# EAGLE design T08_rc360detector (EAGLE 7.4.0)
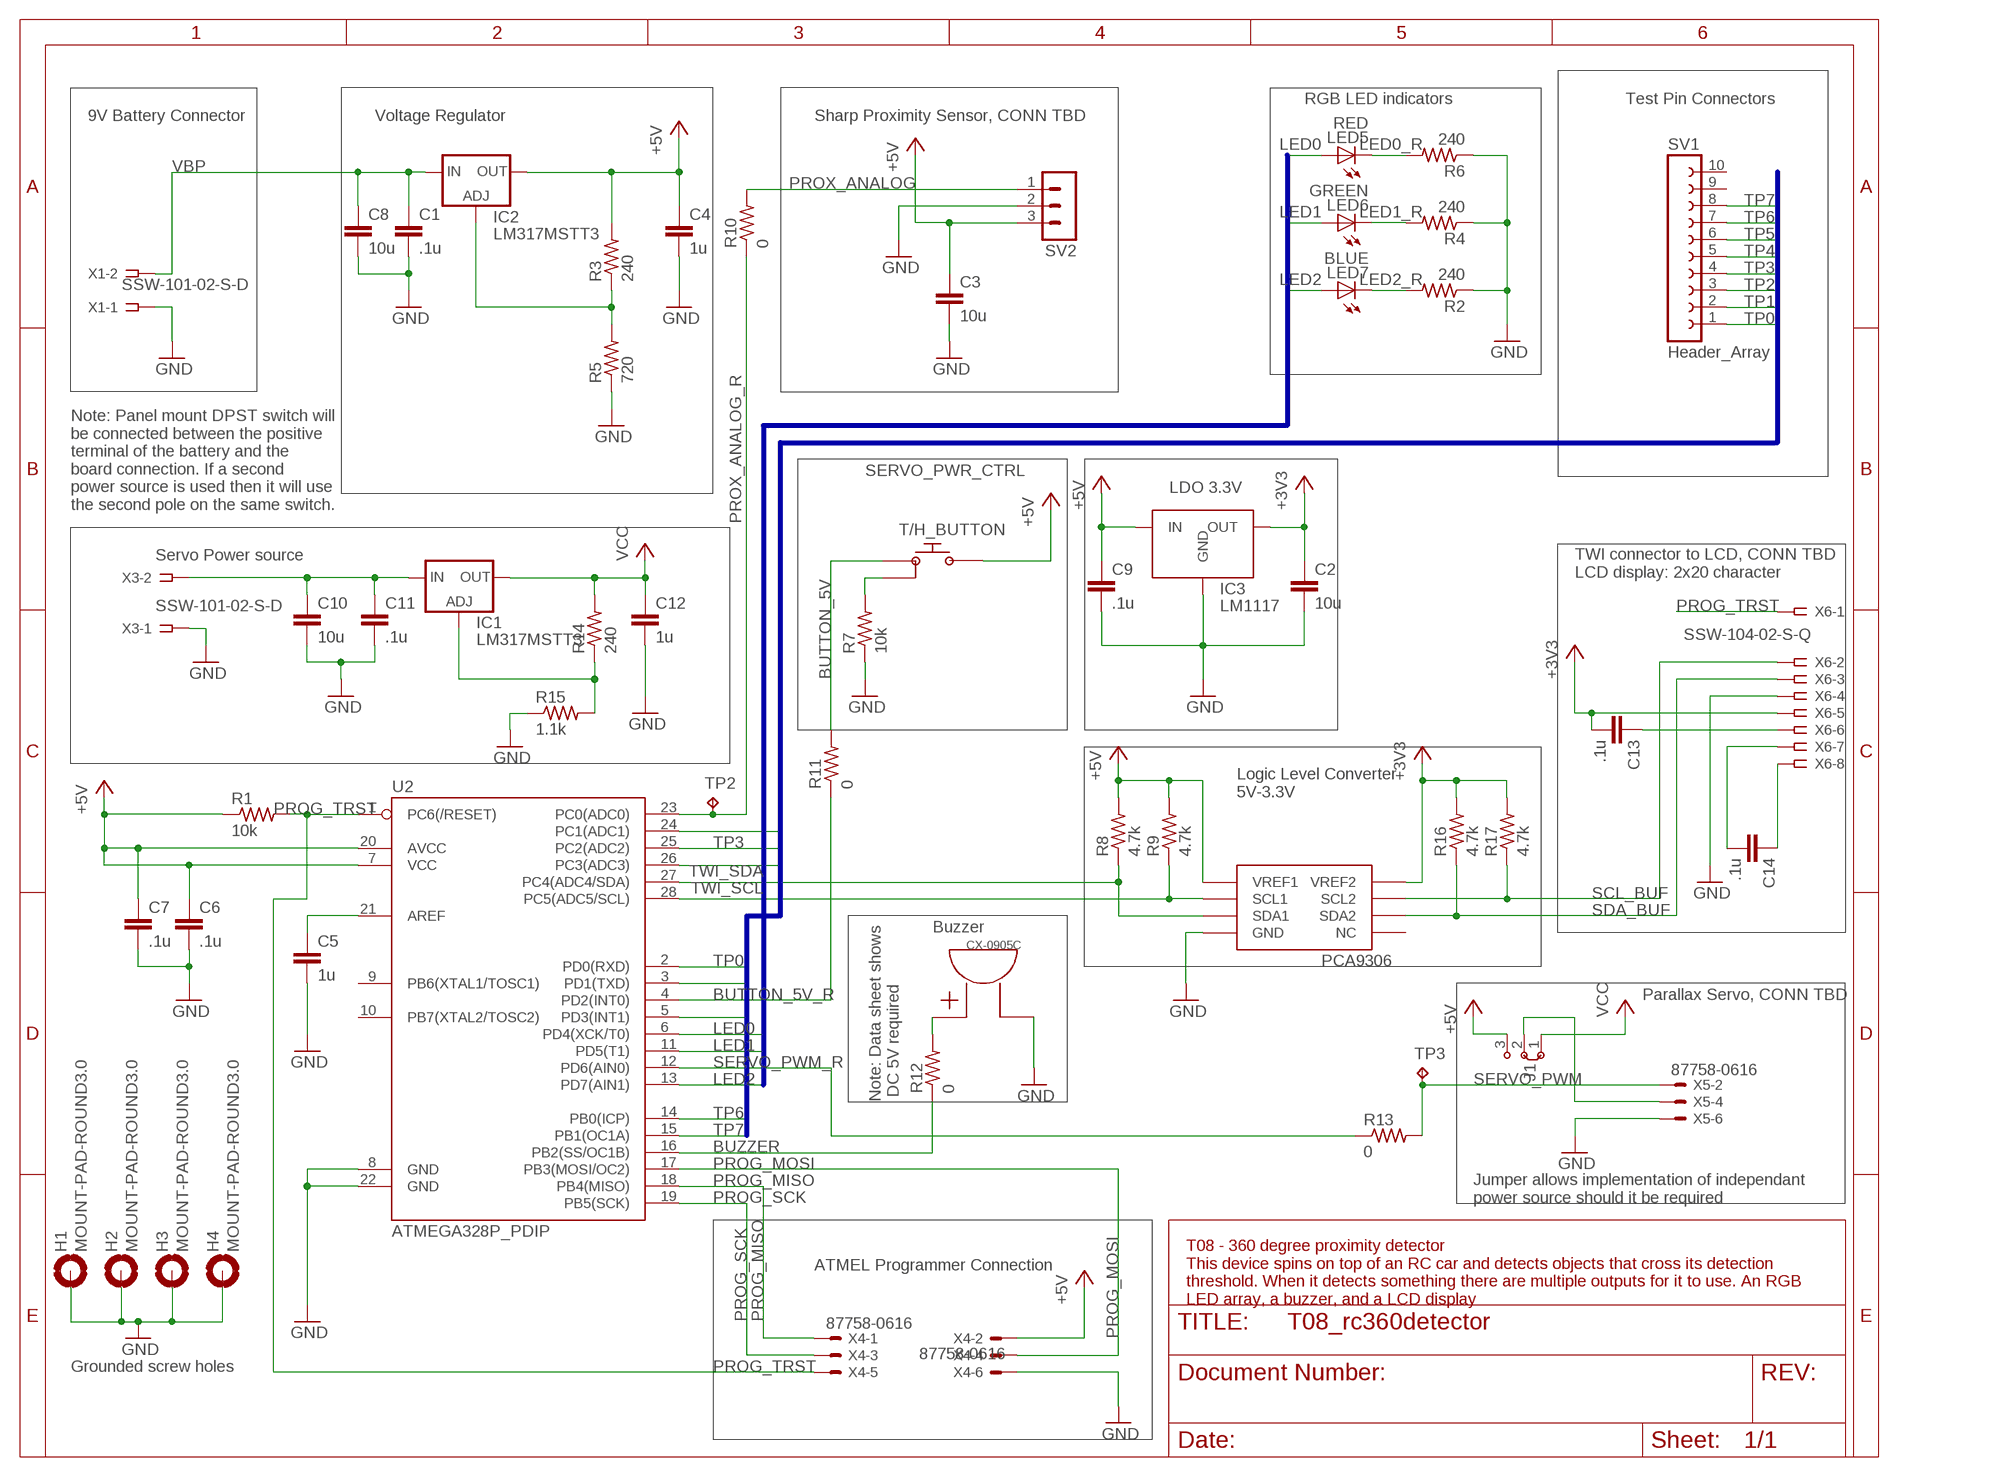
[diagram p0: schematic, sheet 1]

## Parts
C1  .1u  C-EUC0805  [C0805]
C2  10u  C-EUC0805  [C0805]
C3  10u  C-EUC0805  [C0805]
C4  1u  C-EUC0805  [C0805]
C5  1u  C-EUC0805  [C0805]
C6  .1u  C-EUC0805  [C0805]
C7  .1u  C-EUC0805  [C0805]
C8  10u  C-EUC0805  [C0805]
C9  .1u  C-EUC0805  [C0805]
C10  10u  C-EUC0805  [C0805]
C11  .1u  C-EUC0805  [C0805]
C12  1u  C-EUC0805  [C0805]
C13  .1u  C-EUC0805  [C0805]
C14  .1u  C-EUC0805  [C0805]
CX-0905C  CX-0905C  [BUZZER_CX-0905C]
H1  MOUNT-PAD-ROUND3.0  [3,0-PAD]
H2  MOUNT-PAD-ROUND3.0  [3,0-PAD]
H3  MOUNT-PAD-ROUND3.0  [3,0-PAD]
H4  MOUNT-PAD-ROUND3.0  [3,0-PAD]
IC1  LM317MSTT3  [SOT223]
IC2  LM317MSTT3  [SOT223]
IC3  LM1117  [SOT-223]
J1  J2X2MM  [04C]
LED5  RED  LEDLD260  [LD260]
LED6  GREEN  LEDLD260  [LD260]
LED7  BLUE  LEDLD260  [LD260]
PCA9306  PCA9306_BREAKOUT  [PCA9306_BREAKOUT]
R1  10k  R-US_R0805  [R0805]
R2  240  R-US_R0805  [R0805]
R3  240  R-US_R0805  [R0805]
R4  240  R-US_R0805  [R0805]
R5  720  R-US_R0805  [R0805]
R6  240  R-US_R0805  [R0805]
R7  10k  R-US_R0805  [R0805]
R8  4.7k  R-US_R0805  [R0805]
R9  4.7k  R-US_R0805  [R0805]
R10  0  R-US_R0805  [R0805]
R11  0  R-US_R0805  [R0805]
R12  0  R-US_R0805  [R0805]
R13  0  R-US_R0805  [R0805]
R14  240  R-US_R0805  [R0805]
R15  1.1k  R-US_R0805  [R0805]
R16  4.7k  R-US_R0805  [R0805]
R17  4.7k  R-US_R0805  [R0805]
SV1  Header_Array  FE10-1  [FE10]
SV2  MA03-1  [MA03-1]
T/H_BUTTON  PR141C  [3_THROUGH_HOLE]
TP2  TPPAD1-17  [P1-17]
TP3  TPPAD1-17  [P1-17]
U2  ATMEGA328P_PDIP  [DIL28-3]
X1  SSW-101-02-S-D  [SSW-101-02-S-D]
X3  SSW-101-02-S-D  [SSW-101-02-S-D]
X4  87758-0616  [87758-0616]
X5  87758-0616  [87758-0616]
X6  SSW-104-02-S-Q  [SSW-104-02-S-Q]

## Nets
+3V3: C2.1 C13.2 IC3.VOUT(OUT) PCA9306.VREF2 R16.2 R17.2 X6.5
+5V: C3.1 C4.1 C6.1 C7.1 C9.1 IC2.4(OUT) IC3.IN J1.3 PCA9306.VREF1 R1.1 R3.2 R8.2 R9.2 SV2.3 T/H_BUTTON.P$3(OUT) U2.7(VCC) U2.20(AVCC) X4.2
AREF: C5.1 U2.21(AREF)
BUTTON_5V: R11.2 T/H_BUTTON.P$1(IN)
BUTTON_5V_R: R11.1 U2.4(PD2(INT0))
BUZZER: R12.1 U2.16(PB2(SS/OC1B))
GND: C1.2 C2.2 C3.2 C4.2 C5.2 C6.2 C7.2 C8.2 C9.2 C10.2 C11.2 C12.2 CX-0905C.OUT H1.B3,0(MOUNT) H2.B3,0(MOUNT) H3.B3,0(MOUNT) H4.B3,0(MOUNT) IC3.GND PCA9306.GND R2.1 R4.1 R5.1 R6.1 R7.1 R15.1 SV2.2 U2.8(GND) U2.22(GND) X1.1 X3.1 X4.6 X5.6 X6.4
LED0: LED5.A U2.6(PD4(XCK/T0))
LED0_R: LED5.K(C) R6.2
LED1: LED6.A U2.11(PD5(T1))
LED1_R: LED6.K(C) R4.2
LED2: LED7.A U2.13(PD7(AIN1))
LED2_R: LED7.K(C) R2.2
N$1: R7.2 T/H_BUTTON.P$2(GND)
N$2: IC2.1(ADJ) R3.1 R5.2
N$4: CX-0905C.IN R12.2
N$13: IC1.1(ADJ) R14.1 R15.2
N$14: C10.1 C11.1 IC1.3(IN) X3.2
N$16: J1.2 X5.4
N$18: C13.1 X6.6
N$19: C14.2 X6.7
N$20: C14.1 X6.8
PROG_MISO: U2.18(PB4(MISO)) X4.1
PROG_MOSI: U2.17(PB3(MOSI/OC2)) X4.4
PROG_SCK: U2.19(PB5(SCK)) X4.3
PROG_TRST: R1.2 U2.1(PC6(/RESET)) X4.5 X6.1
PROX_ANALOG: R10.2 SV2.1
PROX_ANALOG_R: R10.1 TP2.TP U2.23(PC0(ADC0))
SCL_BUF: PCA9306.SCL2 R17.1 X6.2
SDA_BUF: PCA9306.SDA2 R16.1 X6.3
SERVO_PWM: R13.2 TP3.TP X5.2
SERVO_PWM_R: R13.1 U2.12(PD6(AIN0))
TP0: SV1.1 U2.2(PD0(RXD))
TP1: SV1.2 U2.3(PD1(TXD))
TP2: SV1.3 U2.26(PC3(ADC3))
TP3: SV1.4 U2.25(PC2(ADC2))
TP4: SV1.5 U2.5(PD3(INT1))
TP5: SV1.6 U2.24(PC1(ADC1))
TP6: SV1.7 U2.14(PB0(ICP))
TP7: SV1.8 U2.15(PB1(OC1A))
TWI_SCL: PCA9306.SCL1 R9.1 U2.28(PC5(ADC5/SCL))
TWI_SDA: PCA9306.SDA1 R8.1 U2.27(PC4(ADC4/SDA))
VBP: C1.1 C8.1 IC2.3(IN) X1.2
VCC: C12.1 IC1.4(OUT) J1.1 R14.2
Unconnected: PCA9306.NC SV1.9 SV1.10 U2.9(PB6(XTAL1/TOSC1)) U2.10(PB7(XTAL2/TOSC2)) X5.1 X5.3 X5.5

## Buses
LED[0..2]
TP[0..13]

## Notes on the sheet
- RGB LED indicators | Test Pin Connectors
- 9V Battery Connector | Voltage Regulator | Sharp Proximity Sensor, CONN TBD
- SERVO_PWR_CTRL
- LDO 3.3V
- Note: Panel mount DPST switch will
  be connected between the positive
  terminal of the battery and the 
  board connection. If a second 
  power source is used then it will use
  the second pole on the same switch.
- Servo Power source
- TWI connector to LCD, CONN TBD
  LCD display: 2x20 character
- Logic Level Converter
  5V-3.3V
- Buzzer
- Parallax Servo, CONN TBD
- Note: Data sheet shows
   DC 5V required
- Jumper allows implementation of independant 
  power source should it be required
- ATMEL Programmer Connection
- T08 - 360 degree proximity detector
  This device spins on top of an RC car and detects objects that cross its detection
  threshold. When it detects something there are multiple outputs for it to use. An RGB 
  LED array, a buzzer, and a LCD display
- Grounded screw holes

## Library data of the parts
C1 C4 C5 C9 C11-C14 = resistor:C-EU: CAPACITOR, European symbol
C2 C3 C6-C8 C10 = rcl:C-EU: CAPACITOR, European symbol
CX-0905C = 360prox:CX-0905C
H1-H4 = holes:MOUNT-PAD-ROUND: MOUNTING PAD, round
IC1 IC2 = v-reg:LM317?*: 500 mA Adjustable Output Positive Voltage Regulator Source: http://www.onsemi.co.jp .. LM317M-D.PDF
IC3 = 360prox:LM1117
J1 = jumper:J2: Jumper switch 2 x 2.5 mm
LED5-LED7 = led:LED: LED OSRAM: - CHIPLED LG R971, LG N971, LY N971, LG Q971, LY Q971, LO R971, LY R971 LH N974, LH R974 LS Q976, LO Q976, LY Q976 LO Q996 - Hyper CHIPLED LW Q18S LB Q993, LB Q99A, LB R99A - SideLED LS A670, LO A670, LY A670, LG A670, LP A670 LB A673, LV A673, LT A673, LW A673 LH A674 LY A675 LS A676, LA A676, LO A676, LY A676, LW A676 LS A679, LY A679, LG A679 - Hyper Micro SIDELED® LS Y876, LA Y876, LO Y876, LY Y876 LT Y87S - SmartLED LW L88C, LW L88S LB L89C, LB L89S, LG L890 LS L89K, LO L89K, LY L89K LS L896, LA L896, LO L896, LY L896 - TOPLED LS T670, LO T670, LY T670, LG T670, LP T670 LSG T670, LSP T670, LSY T670, LOP T670, LYG T670 LG T671, LOG T671, LSG T671 LB T673, LV T673, LT T673, LW T673 LH T674 LS T676, LA T676, LO T676, LY T676, LB T676, LH T676, LSB T676, LW T676 LB T67C, LV T67C, LT T67C, LS T67K, LO T67K, LY T67K, LW E67C LS E67B, LA E67B, LO E67B, LY E67B, LB E67C, LV E67C, LT E67C LW T67C LS T679, LY T679, LG T679 LS T770, LO T770, LY T770, LG T770, LP T770 LB T773, LV T773, LT T773, LW T773 LH T774 LS E675, LA E675, LY E675, LS T675 LS T776, LA T776, LO T776, LY T776, LB T776 LHGB T686 LT T68C, LB T68C - Hyper Mini TOPLED® LB M676 - Mini TOPLED Santana® LG M470 LS M47K, LO M47K, LY M47K Source: http://www.osram.convergy.de LUXEON: - LUMILED® LXK2-PW12-R00, LXK2-PW12-S00, LXK2-PW14-U00, LXK2-PW14-V00 LXK2-PM12-R00, LXK2-PM12-S00, LXK2-PM14-U00 LXK2-PE12-Q00, LXK2-PE12-R00, LXK2-PE12-S00, LXK2-PE14-T00, LXK2-PE14-U00 LXK2-PB12-K00, LXK2-PB12-L00, LXK2-PB12-M00, LXK2-PB14-N00, LXK2-PB14-P00, LXK2-PB14-Q00 LXK2-PR12-L00, LXK2-PR12-M00, LXK2-PR14-Q00, LXK2-PR14-R00 LXK2-PD12-Q00, LXK2-PD12-R00, LXK2-PD12-S00 LXK2-PH12-R00, LXK2-PH12-S00 LXK2-PL12-P00, LXK2-PL12-Q00, LXK2-PL12-R00 Source: www.luxeon.com KINGBRIGHT: KA-3528ASYC Source: www.kingbright.com
PCA9306 = 360prox:PCA9306_BREAKOUT
R1-R17 = rcl:R-US_: RESISTOR, American symbol
SV1 = con-lsta:FE10-1: FEMALE HEADER; OC_FARNELL: unknown; OC_NEWARK: unknown
SV2 = con-lstb:MA03-1: PIN HEADER; OC_FARNELL: unknown; OC_NEWARK: unknown
T/H_BUTTON = 360prox:PR141C
TP2 TP3 = testpad:TP: Test pad
U2 = SparkFun-DigitalIC:ATMEGA328P_PDIP: uC used in the Arduino 32kb flash, 1k EEPROM, 2k SRAM This is the through-hole version of this chip.
X1 X3 = con-samtec:SSW-101-02-S-D: THROUGH-HOLE .025" SQ POST SOCKET Source: Samtec SSW.pdf; MPN: SSW-101-02-S-D; OC_FARNELL: unknown; OC_NEWARK: 82P1456
X4 X5 = con-molex:87758-0616: 6 Pin - 2mm Dual Row Single Wafer, Vertical T/H HDR Source: http://www.molex.com/pdm_docs/sd/877580616_sd.pdf; MPN: 87758-0616; OC_FARNELL: 7472323; OC_NEWARK: 25M5667
X6 = con-samtec:SSW-104-02-S-Q: THROUGH-HOLE .025" SQ POST SOCKET Source: Samtec SSW.pdf; MPN: SSW-104-02-S-Q; OC_FARNELL: unknown; OC_NEWARK: 82P2475

## Board
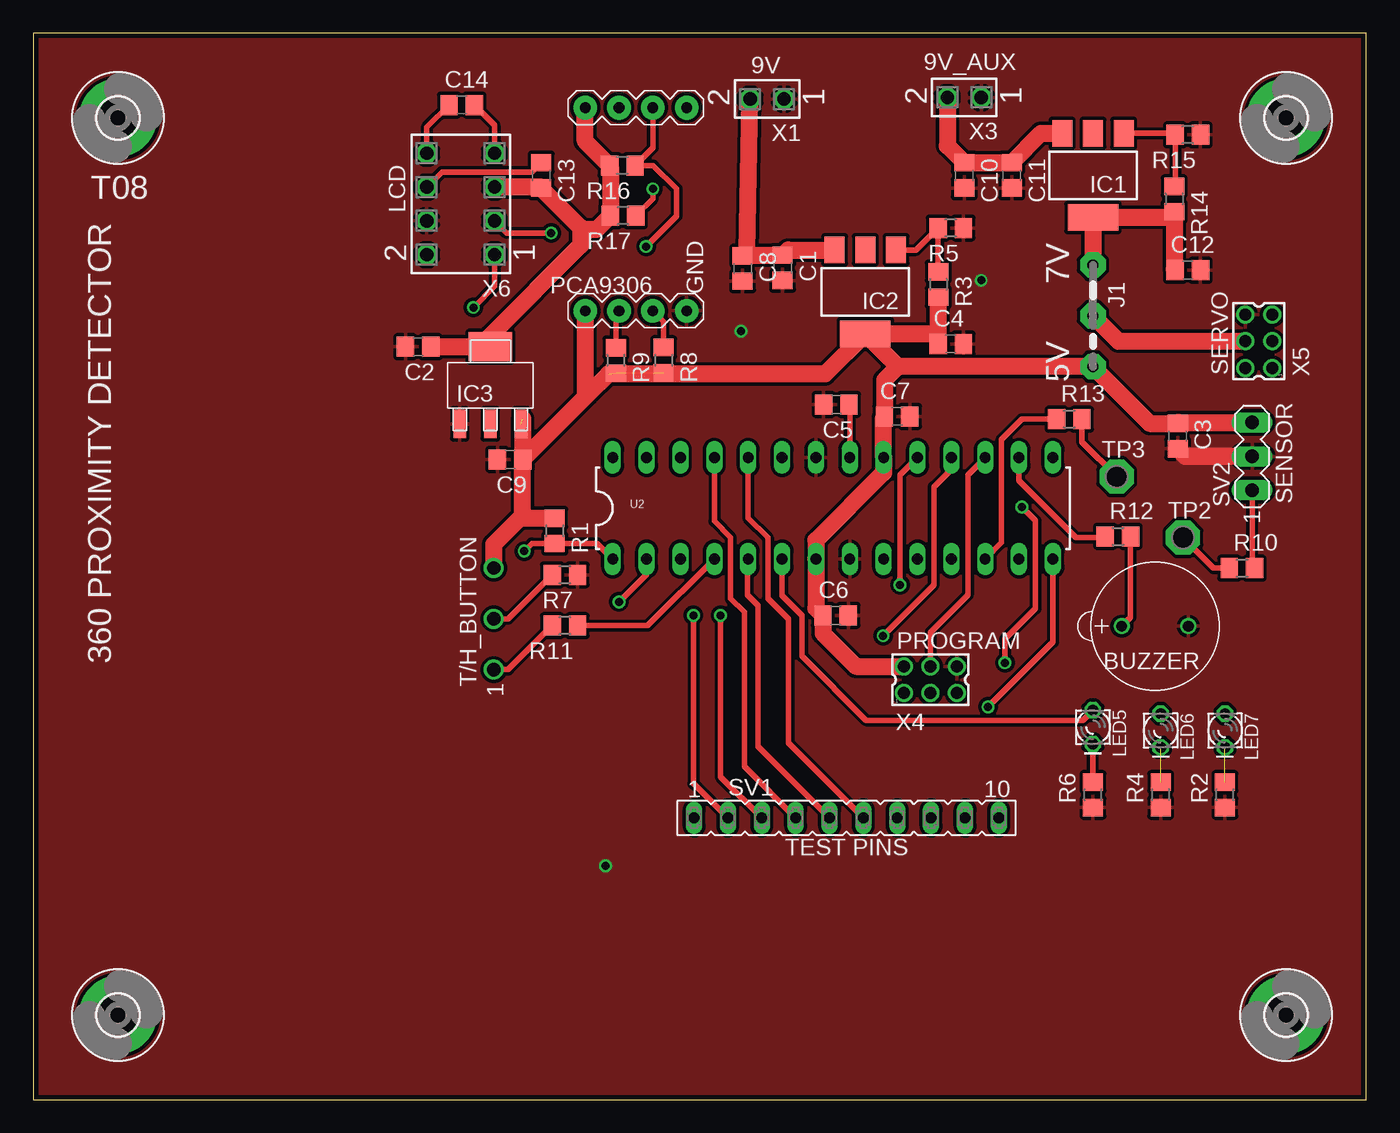
[diagram p1: board, top side]
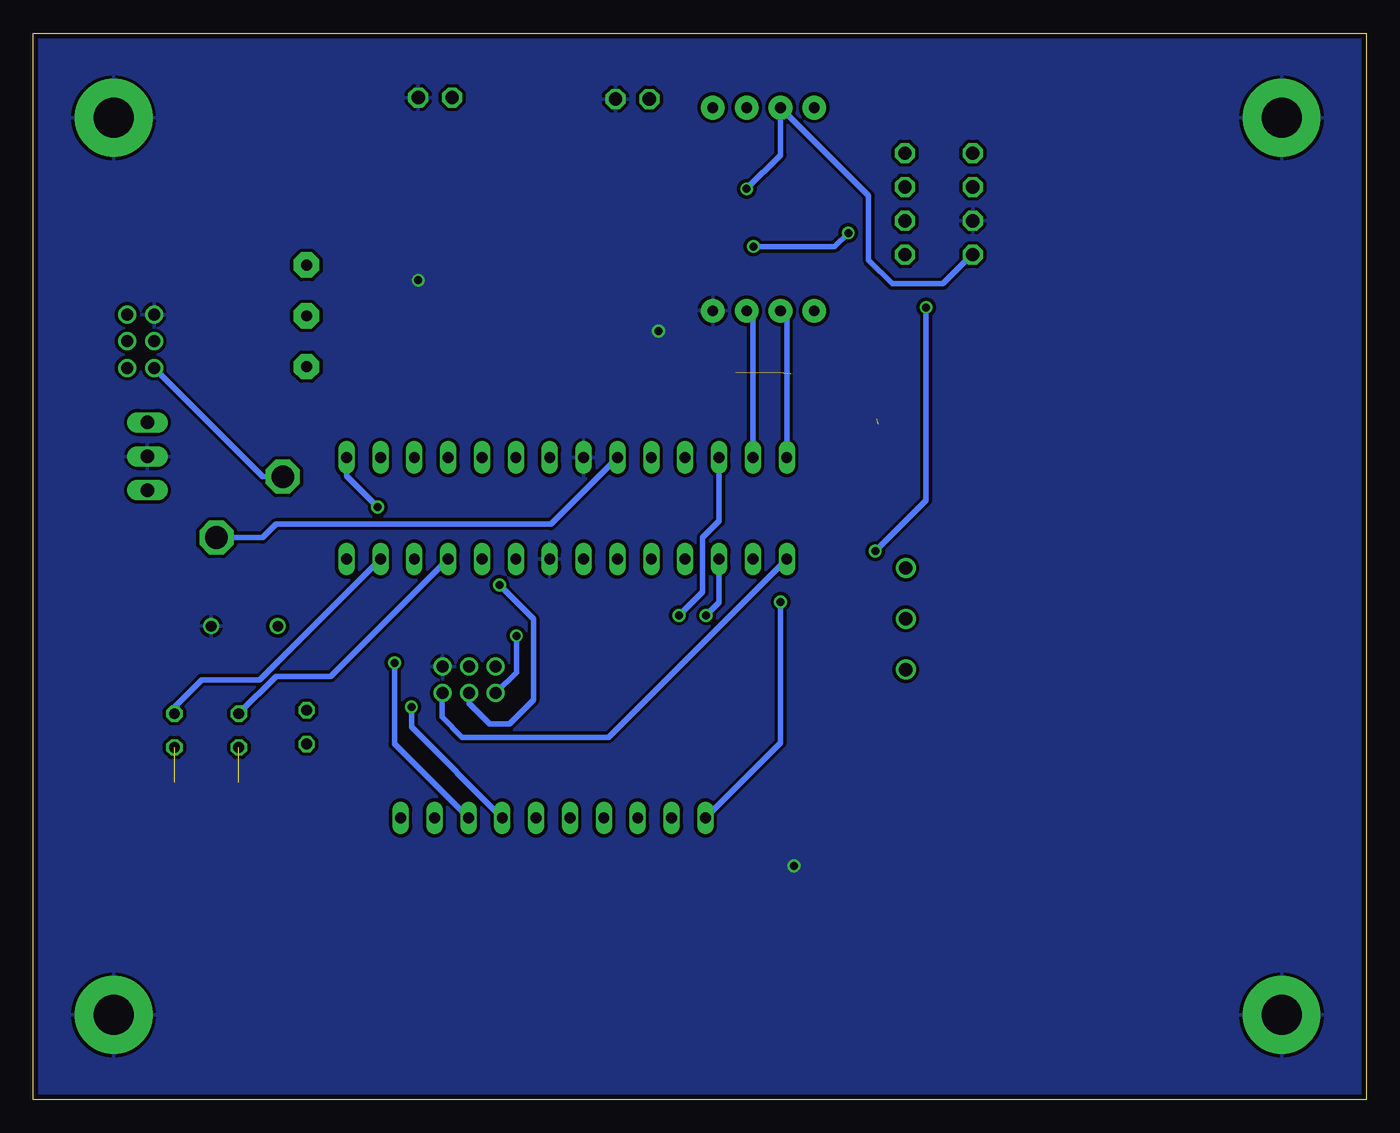
[diagram p2: board, bottom side, seen from below]

Size 100 x 80 mm. Coordinates in mm from the lower left corner, seen from the top.
Outline: 0,0 100,0 100,80 0,80 0,0
Copper layers (1*16): Top 0.0356mm / dielectric 1.5011mm / Bottom 0.0356mm
Design rules "OSH-Park-2-layer": minimum track width 6mil, minimum drill 13mil, track to track 6mil, track to pad 6mil, pad to pad 6mil, via to via 6mil, smd to smd 6mil, copper to edge 15mil, drill to drill 6mil, minimum pad ring 7mil, minimum via ring 7mil, stop-mask expansion 3mil, vias tented up to drill 0mil, thermal gap 10mil

### Footprints (pad centres in the part's own frame; a part is rotated, then mirrored left to right if it is on the bottom)
C0805 = smd 1.3 x 1.5: 1 -0.95,0; 2 0.95,0
BUZZER_CX-0905C = drill 0.8: IN 0,2.5; OUT 0,-2.5
3,0-PAD = drill 3 pad 5.842: B3,0 0,0
SOT223 = smd 1.5 x 2: 1 -2.3,-3.15; 2 0,-3.15; 3 2.3,-3.15 | smd 3.8 x 2: 4 0,3.15
SOT-223 = smd 0.95 x 2.15: GND -2.3,-2.9; IN 2.3,-2.9; OUT 0,-2.9 | smd 3.25 x 2.15: VOUT 0,2.9
04C = drill 0.813 pad 1.905 octagon: 1 -1.905,0; 2 1.905,0; 3 5.715,0
LD260 = drill 0.813 octagon: A -1.27,0; K 1.27,0
PCA9306_BREAKOUT = drill 0.8 pad 1.778: GND 1.27,1.27; NC 16.51,1.27; SCL1 1.27,6.35; SCL2 16.51,6.35; SDA1 1.27,3.81; SDA2 16.51,3.81; VREF1 1.27,8.89; VREF2 16.51,8.89
R0805 = smd 1.3 x 1.5: 1 -0.95,0; 2 0.95,0
FE10 = drill 0.813 long: 1 -11.43,0; 2 -8.89,0; 3 -6.35,0; 4 -3.81,0; 5 -1.27,0; 6 1.27,0; 7 3.81,0; 8 6.35,0; 9 8.89,0; 10 11.43,0
MA03-1 = drill 1.016 long: 1 -2.54,0; 2 0,0; 3 2.54,0
3_THROUGH_HOLE = drill 1: P$1 0,0; P$2 3.81,0; P$3 7.62,0
P1-17 = drill 1.702 pad 2.54 octagon: TP 0,0
DIL28-3 = drill 0.813 long: 1 -16.51,-3.81; 2 -13.97,-3.81; 3 -11.43,-3.81; 4 -8.89,-3.81; 5 -6.35,-3.81; 6 -3.81,-3.81; 7 -1.27,-3.81; 8 1.27,-3.81; 9 3.81,-3.81; 10 6.35,-3.81; 11 8.89,-3.81; 12 11.43,-3.81; 13 13.97,-3.81; 14 16.51,-3.81; 15 16.51,3.81; 16 13.97,3.81; 17 11.43,3.81; 18 8.89,3.81; 19 6.35,3.81; 20 3.81,3.81; 21 1.27,3.81; 22 -1.27,3.81; 23 -3.81,3.81; 24 -6.35,3.81; 25 -8.89,3.81; 26 -11.43,3.81; 27 -13.97,3.81; 28 -16.51,3.81
SSW-101-02-S-D = drill 1 pad 1.5 octagon: 1 0,-1.27; 2 0,1.27
87758-0616 = drill 0.9 pad 1.27: 1 -2,-1; 2 -2,1; 3 0,-1; 4 0,1; 5 2,-1; 6 2,1
SSW-104-02-S-Q = drill 1 pad 1.5 octagon: 1 -3.81,-2.54; 2 -3.81,2.54; 3 -1.27,-2.54; 4 -1.27,2.54; 5 1.27,-2.54; 6 1.27,2.54; 7 3.81,-2.54; 8 3.81,2.54

### Placement (x,y rotation side)
C1  56.22,62.4 270 top
C2  28.87,56.48 180 top
C3  85.85,49.78 270 top
C4  68.83,56.69 0 top
C5  60.24,52.15 180 top
C6  60.2,36.32 0 top
C7  64.81,51.25 0 top
C8  53.21,62.35 270 top
C9  35.77,48.02 180 top
C10  69.85,69.34 270 top
C11  73.41,69.34 270 top
C12  86.61,62.23 0 top
C13  38.1,69.34 270 top
C14  32.14,74.62 0 top
CX-0905C  84.16,35.52 90 top
H1  6.35,6.35 0 top
H2  93.98,6.35 0 top
H3  93.98,73.66 0 top
H4  6.35,73.66 0 top
IC1  79.5,69.34 180 top
IC2  62.42,60.6 180 top
IC3  34.29,53.59 0 top
J1  79.5,60.71 270 top
LED5  79.5,27.94 270 top
LED6  84.58,27.69 270 top
LED7  89.41,27.69 270 top
PCA9306  50.29,57.91 90 top
R1  39.12,42.67 270 top
R2  89.41,22.86 90 top
R3  67.9,61.16 270 top
R4  84.58,22.86 90 top
R5  68.83,65.39 180 top
R6  79.5,22.86 90 top
R7  39.88,39.37 180 top
R8  47.29,55.48 270 top
R9  43.7,55.46 270 top
R10  90.68,39.88 0 top
R11  39.88,35.56 180 top
R12  81.37,42.25 0 top
R13  77.72,51.05 0 top
R14  85.6,67.56 270 top
R15  86.61,72.39 180 top
R16  44.19,70.08 180 top
R17  44.24,66.32 180 top
SV1  61.01,21.13 0 top
SV2  91.44,48.26 90 top
T/H_BUTTON  34.54,32.26 90 top
TP2  86.26,42.16 0 top
TP3  81.28,46.74 0 top
U2  59.98,44.37 0 top
X1  55.05,75.07 90 top
X3  69.85,75.18 90 top
X4  67.31,31.5 0 top
X5  91.95,56.9 90 top
X6  32.06,67.2 90 top

### Tracks (layer width: path | path; a pad name or v marks a point on that pad's centre or on a via)
+3V3
  Top 1.27: PCA9306.VREF2 41.4,71.92 R16.2 arc-45 43.29,69.95 R17.2 42.25,65.28 41.07,65.28 | C2.1 29.83,56.49 IC3.VOUT 34.29,57.31 41.07,64.09 41.07,65.28 | 41.07,65.28 41.07,65.43 C13.2 38.02,68.47 X6.5
+5V  (3 unrouted)
  Top 1.27: SV2.3 85.92,50.8 C3.1 83.76,50.73 J1.3 64.88,54.99 | IC2.4 67.88,57.45 C4.1 67.88,60.21 R3.2 | 64.88,54.99 IC2.4 | 64.88,54.99 63.86,53.97 C7.1 63.79,51.19 U2.20 63.79,47.03 58.71,41.95 U2.7 58.71,36.86 C6.1 59.25,34.99 61.72,32.51 65.29,32.51 X4.2 | 36.72,43.83 C9.1 | IC2.4 59.41,54.44 43.14,54.44 41.59,52.9 | 41.59,52.9 C9.1 | PCA9306.VREF1 41.4,53.09 41.59,52.9 | 36.72,43.83 34.54,41.66 T/H_BUTTON.P$3 | 36.72,43.83 36.93,43.62 R1.1 | 36.72,51.07 C9.1
AREF
  Top 0.406: U2.21 61.25,52.09 C5.1
BUTTON_5V
  Top 0.406: R11.2 35.63,32.26 T/H_BUTTON.P$1
BUTTON_5V_R
  Top 0.406: R11.1 46.1,35.56 U2.4
BUZZER
  Top 0.406: U2.16 73.95,46.44 78.23,42.16 80.34,42.16 R12.1
GND  (via drill 0.6)
  Top 1.27: SV2.2 86.43,48.26 C3.2
  other vias: 53.09,57.66 71.12,61.47 42.93,17.53
  pour Bottom (isolate 0.254): 0,0 99.82,0 99.82,80.01 0,80.01
  pour Top (isolate 0.254): 0,0 99.82,0 99.82,80.01 0,80.01
LED0
  Top 0.406: U2.6 56.17,37.81 57.66,36.32 57.66,33.27 62.48,28.45 78.74,28.45 LED5.A
LED0_R
  Top 0.406: R6.2 LED5.K
LED1
  Bottom 0.406: U2.11 77.68,31.75 81.79,31.75 LED6.A
LED1_R  (1 unrouted)
LED2
  Bottom 0.406: U2.13 83.02,31.5 87.38,31.5 89.41,29.46 LED7.A
LED2_R  (1 unrouted)
N$1
  Top 0.406: R7.2 35.63,36.07 T/H_BUTTON.P$2
N$2
  Top 0.406: IC2.1 66.23,63.75 R5.2 67.88,62.14 R3.1
N$4
  Top 0.406: R12.2 82.32,36.18 CX-0905C.IN
N$13
  Top 0.406: IC1.1 85.56,72.49 R15.2 85.66,68.58 R14.1
N$14
  Top 1.27: X3.2 68.58,71.56 C10.1 C11.1 75.61,72.49 IC1.3
N$16
  Top 1.27: J1.2 81.41,56.9 X5.4
N$18
  Top 0.406: C13.1 37.4,69.6 30.65,69.6 X6.6
N$19
  Top 0.406: C14.2 34.6,73.11 X6.7
N$20
  Top 0.406: C14.1 29.52,72.95 X6.8
PROG_MISO  (via drill 0.6)
  Top 0.406: v63.75,34.8 67.56,38.61 67.56,45.97 68.87,47.28 U2.18
  Bottom 0.406: X4.1 63.75,32.05 v63.75,34.8
PROG_MOSI
  Top 0.406: U2.17 70.1,46.87 70.1,37.85 67.31,35.05 X4.4
PROG_SCK  (via drill 0.6)
  Top 0.406: U2.19 65.02,46.87 v65.02,38.61
  Bottom 0.406: v65.02,38.61 62.48,36.07 62.48,29.97 64.26,28.19 65.79,28.19 67.31,29.72 X4.3
PROG_TRST  (via drill 0.6)
  Top 0.406: U2.1 42.31,41.72 R1.2 37.4,41.72 v36.83,41.15 | X6.1 34.6,61.02 v33.02,59.44
  Bottom 0.406: U2.1 56.85,27.18 67.82,27.18 69.34,28.7 69.34,30.46 X4.5 | v33.02,59.44 33.02,44.96 v36.83,41.15
PROX_ANALOG
  Top 0.406: R10.2 91.44,40.07 SV2.1
PROX_ANALOG_R
  Top 0.406: TP2.TP 88.54,39.88 R10.1
  Bottom 0.406: U2.23 61.17,43.18 81.79,43.18 82.81,42.16 TP2.TP
SCL_BUF  (via drill 0.6)
  Top 0.406: R17.1 46.48,67.61 v46.48,68.33
  Bottom 0.406: v46.48,68.33 43.94,70.87 PCA9306.SCL2 37.34,67.82 37.34,62.99 35.56,61.21 31.75,61.21 29.58,63.39 X6.2
SDA_BUF  (via drill 0.6)
  Top 0.406: PCA9306.SDA2 46.48,71.42 R16.1 46.51,70.08 48.26,68.33 48.26,66.29 v45.97,64.01 | v38.86,65.02 35.51,65.02 X6.3
  Bottom 0.406: v45.97,64.01 39.88,64.01 v38.86,65.02
SERVO_PWM
  Top 0.406: R13.2 78.67,49.34 TP3.TP
  Bottom 0.406: TP3.TP 82.79,46.74 X5.2
SERVO_PWM_R
  Top 0.406: 76.49,50.77 R13.1 74.17,51.05 72.64,49.53 72.64,41.79 U2.12
TP0  (via drill 0.6)
  Top 0.406: U2.2 46.01,39.41 v43.94,37.34
  Bottom 0.406: v43.94,37.34 43.94,26.76 SV1.1
TP1  (via drill 0.6)
  Top 0.406: v49.53,36.32 49.53,23.71 SV1.2
  Bottom 0.406: U2.3 48.55,37.3 v49.53,36.32
TP2  (via drill 0.6)
  Top 0.406: v51.56,36.32 51.56,24.22 SV1.3
  Bottom 0.406: U2.26 48.55,43.39 49.78,42.16 49.78,38.1 v51.56,36.32
TP3
  Top 0.406: U2.25 51.09,43.39 52.32,42.16 52.32,37.59 53.34,36.58 53.34,24.98 SV1.4
TP4
  Top 0.406: U2.5 53.59,40.56 53.59,37.85 54.36,37.08 54.36,26.51 SV1.5
TP5
  Top 0.406: U2.24 53.63,43.65 55.12,42.16 55.12,37.59 56.64,36.07 56.64,26.76 SV1.6
TP6  (via drill 0.6)
  Top 0.406: U2.14 76.49,34.33 v71.63,29.46
  Bottom 0.406: v71.63,29.46 71.63,27.94 SV1.7
TP7  (via drill 0.6)
  Top 0.406: v74.17,44.45 75.18,43.43 75.18,36.83 72.9,34.54 v72.9,32.77
  Bottom 0.406: U2.15 76.49,46.78 v74.17,44.45 | v72.9,32.77 72.9,26.67 SV1.8
TWI_SCL
  Top 0.406: R9.1 43.7,58.94 PCA9306.SCL1
  Bottom 0.406: U2.28 43.47,58.71 PCA9306.SCL1
TWI_SDA
  Top 0.406: R8.1 47.29,58.38 PCA9306.SDA1
  Bottom 0.406: U2.27 46.01,58.71 PCA9306.SDA1
VBP
  Top 1.27: IC2.3 56.62,63.75 C1.1 53.26,63.35 C8.1 53.53,63.61 X1.2
VCC
  Top 1.27: J1.1 IC1.4 85.18,66.19 R14.2 85.6,62.3 C12.1

### Text on the board
tPlace: 9V | 9V_AUX | T08 | LCD | 360 PROXIMITY DETECTOR | 7V | 5V | SERVO | SENSOR | PROGRAM | BUZZER | TEST PINS